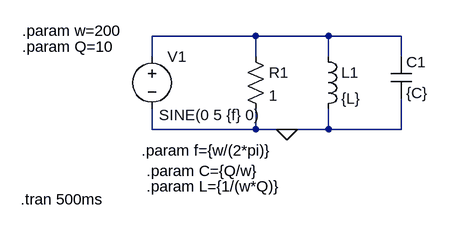
[diagram p0: schematic Circuito RLC paralelo.asc]
Circuito RLC paralelo.asc, the LTspice schematic file:
Version 4
SHEET 1 880 680
WIRE 208 80 48 80
WIRE 320 80 208 80
WIRE 432 80 320 80
WIRE 48 112 48 80
WIRE 208 112 208 80
WIRE 320 112 320 80
WIRE 432 112 432 80
WIRE 48 224 48 192
WIRE 208 224 208 192
WIRE 208 224 48 224
WIRE 256 224 208 224
WIRE 320 224 320 192
WIRE 320 224 256 224
WIRE 432 224 432 176
WIRE 432 224 320 224
FLAG 256 224 0
SYMBOL voltage 48 96 R0
WINDOW 3 11 106 Left 2
WINDOW 123 24 124 Left 2
WINDOW 39 0 0 Left 0
SYMATTR InstName V1
SYMATTR Value SINE(0 5 {f} 0)
SYMBOL res 192 96 R0
SYMATTR InstName R1
SYMATTR Value 1
SYMBOL ind 304 96 R0
SYMATTR InstName L1
SYMATTR Value {L}
SYMBOL cap 416 112 R0
SYMATTR InstName C1
SYMATTR Value {C}
TEXT -152 72 Left 2 !.param w=200
TEXT -152 96 Left 2 !.param Q=10
TEXT 32 256 Left 2 !.param f={w/(2*pi)}
TEXT 40 288 Left 2 !.param C={Q/w}
TEXT 40 312 Left 2 !.param L={1/(w*Q)}
TEXT -154 332 Left 2 !.tran 500ms

The netlist it stands for:
* Circuito RLC paralelo.asc
V1 N001 0 SINE(0 5 {f} 0)
R1 N001 0 1
L1 N001 0 {L}
C1 N001 0 {C}
.param w=200
.param Q=10
.param f={w/(2*pi)}
.param C={Q/w}
.param L={1/(w*Q)}
.tran 500ms
.backanno
.end